# Altium schematic sheet STM32and_conn.SchDoc
size 300 x 299 mm
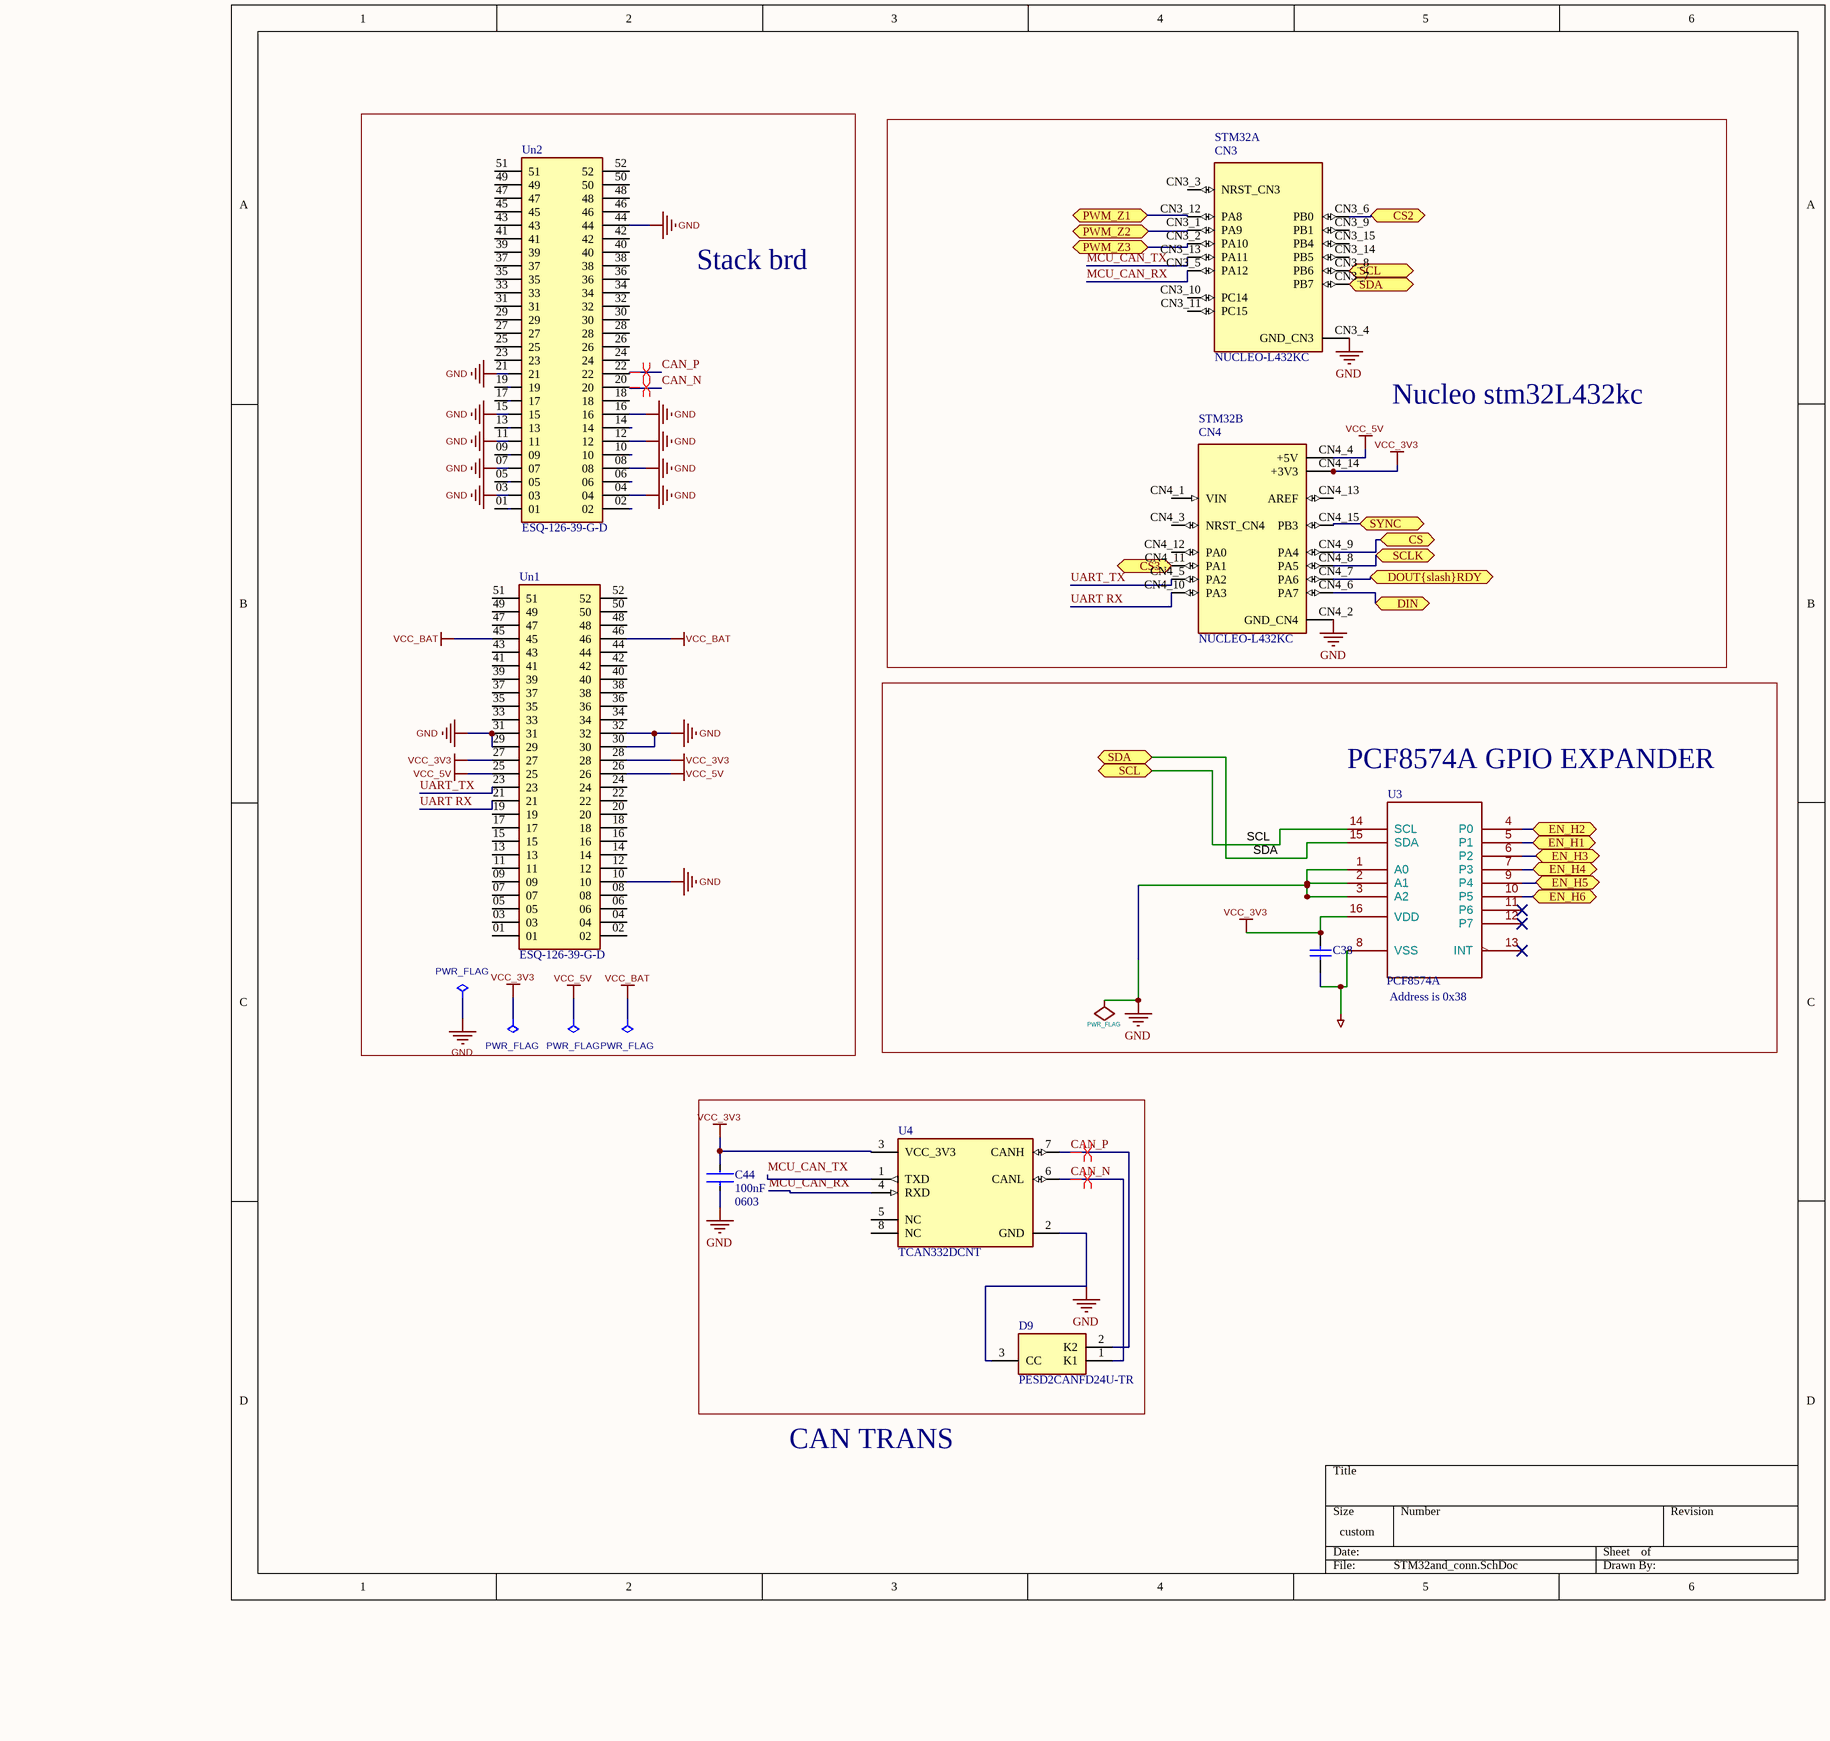
[diagram p0: STM32and_conn.SchDoc]

## Parts
#FLG?#1  PWR_FLAG  (graphical)
#FLG?#2  PWR_FLAG  (graphical)
#FLG?#3  PWR_FLAG  (graphical)
#FLG?#4  PWR_FLAG  (graphical)
#FLG?#5  PWR_FLAG  (graphical)
C38  06035C104KAZ2A  [CAPC1608X90X35LL15T15]  (value not drawn)
C44  Capacitance: 100nF  Case/Package: 0603  [FP-CL10-IPC_A]  (hidden comment: CL10B104KB8WPNC)
D9  PESD2CANFD24U-TR  [SOT95P230X110-3N]
STM32  NUCLEO-L432KC  [MODULE_NUCLEO-L432KC]  (parts A,B of 2)
U3  PCF8574A  [SOIC127P1030X265-16N]
U4  TCAN332DCNT  [FP-DCN0008A-IPC_C]
Un1  ESQ-126-39-G-D  [SAMTEC_ESQ-126-39-G-D]
Un2  ESQ-126-39-G-D  [SAMTEC_ESQ-126-39-G-D]

## Blocks framed on the sheet
Stack brd: #FLG?#1 #FLG?#3-#FLG?#5 Un1 Un2
Nucleo stm32L432kc: STM32
PCF8574A GPIO EXPANDER: #FLG?#2 C38 U3

## Ports
CS2 (bidir), CS3 (bidir), CS (bidir), DIN (bidir), DOUT{slash}RDY (bidir), EN_H1 (bidir), EN_H2 (bidir), EN_H3 (bidir), EN_H4 (bidir), EN_H5 (bidir), EN_H6 (bidir), PWM_Z1 (bidir), PWM_Z2 (bidir), PWM_Z3 (bidir), SCL (bidir), SCLK (bidir), SDA (bidir), SYNC (bidir)

## Nets
GND: #FLG?#1.1 #FLG?#2.1(pwr) C38.1 C44.1 D9.3(CC) STM32.CN3_4(GND_CN3) STM32.CN4_2(GND_CN4) U3.1(A0) U3.2(A1) U3.3(A2) U3.8(VSS) U4.2(GND) Un1.10 Un1.29 Un1.30 Un1.31 Un1.32 Un2.04 Un2.08 Un2.12 Un2.16 Un2.44
VCC_3V3: #FLG?#3.1 C38.2 C44.2 STM32.CN4_14(+3V3) U3.16(VDD) U4.3(VCC_3V3) Un1.27 Un1.28
VCC_5V: #FLG?#4.1 STM32.CN4_4(+5V) Un1.25 Un1.26
VCC_BAT: #FLG?#5.1 Un1.45 Un1.46
CAN_N: D9.1(K1) U4.6(CANL) Un2.20
CAN_P: D9.2(K2) U4.7(CANH) Un2.22
CS: STM32.CN4_9(PA4) ; port CS
CS2: STM32.CN3_6(PB0) ; port CS2
CS3: STM32.CN4_11(PA1) ; port CS3
DIN: STM32.CN4_6(PA7) ; port DIN
DOUT{slash}RDY: STM32.CN4_7(PA6) ; port DOUT{slash}RDY
EN_H1: U3.5(P1) ; port EN_H1
EN_H2: U3.4(P0) ; port EN_H2
EN_H3: U3.6(P2) ; port EN_H3
EN_H4: U3.7(P3) ; port EN_H4
EN_H5: U3.9(P4) ; port EN_H5
EN_H6: U3.10(P5) ; port EN_H6
MCU_CAN_RX: STM32.CN3_5(PA12) U4.4(RXD)
MCU_CAN_TX: STM32.CN3_13(PA11) U4.1(TXD)
PWM_Z1: STM32.CN3_12(PA8) ; port PWM_Z1
PWM_Z2: STM32.CN3_1(PA9) ; port PWM_Z2
PWM_Z3: STM32.CN3_2(PA10) ; port PWM_Z3
SCL: STM32.CN3_8(PB6) U3.14(SCL) ; port SCL
SCLK: STM32.CN4_8(PA5) ; port SCLK
SDA: STM32.CN3_7(PB7) U3.15(SDA) ; port SDA
SYNC: STM32.CN4_15(PB3) ; port SYNC
UART RX: STM32.CN4_10(PA3) Un1.21
UART_TX: STM32.CN4_5(PA2) Un1.23

Not connected (* = marked no-connect by the designer): STM32 CN3_3(NRST_CN3) CN3_9(PB1) CN3_10(PC14) CN3_11(PC15) CN3_14(PB5) CN3_15(PB4) CN4_1(VIN) CN4_3(NRST_CN4) CN4_12(PA0) CN4_13(AREF); U3 11(P6)* 12(P7)* 13(INT)*; U4 5(NC) 8(NC); Un1 01 02 03 04 05 06 07 08 09 11 12 13 14 15 16 17 18 19 20 22 24 33 34 35 36 37 38 39 40 41 42 43 44 47 48 49 50 51 52; Un2 01 02 03 05 06 07 09 10 11 13 14 15 17 18 19 21 23 24 25 26 27 28 29 30 31 32 33 34 35 36 37 38 39 40 41 42 43 45 46 47 48 49 50 51 52

## Layout directives
differential pair: CAN_N, CAN_P

## Notes on the sheet
- (near U3) Address is 0x38
- CAN TRANS
- (in symbol NUCLEO-L432KC, part A) CN3
- (in symbol NUCLEO-L432KC, part B) CN4

## Library data of the parts
C38 = CMP-2006-04391-1: Manufacturer: AVX Interconnect / Elco; Part Number: 06035C104KAZ2A
C44 = CMP-13271-002353-1: Cap Ceramic 100nF 50V X7R ±10% Pad SMD 0603 +125°C T/R; Ratings: AEC-Q200; Features: Soft Termination; Max Operating Temperature: 125°C; Mount: Surface Mount; Width: 0.031inch; Voltage Rating: 50V; Case Code (Metric): 1608; Case Code (Imperial): 0603; Tolerance: 10%; Min Operating Temperature: -55°C; Thickness: 0.035inch; Lead Free: Lead Free; Packaging: Tape and Reel; Length: 0.063inch
D9 = PESD2CANFD24U-TR: Diode; Manufacturer_Name: Nexperia; Datasheet Link: https://assets.nexperia.com/documents/data-sheet/PESD2CANFD24U-T.pdf; Height: 1.1mm; Manufacturer_Part_Number: PESD2CANFD24U-TR; Mouser Part Number: 771-PESD2CANFD24U-TR; Mouser Price/Stock: https://www.mouser.co.uk/ProductDetail/Nexperia/PESD2CANFD24U-TR?qs=vmHwEFxEFR%252BPr2so13o7KA%3D%3D; Arrow Part Number: PESD2CANFD24U-TR; Arrow Price/Stock: https://www.arrow.com/en/products/pesd2canfd24u-tr/nexperia?utm_currency=USD&region=nac
STM32 = NUCLEO-L432KC: STM32L432KC, mbed-Enabled Development Nucleo-32 STM32L4 ARMÂ® CortexÂ®-M4 MCU 32-Bit Embedded Evaluation Board; MF: STMicroelectronics; SnapEDA_Link: https://www.snapeda.com/parts/NUCLEO-L432KC/STMicroelectronics/view-part/?ref=snap; Package: None; Value: *; MP: NUCLEO-L432KC; Check_prices: https://www.snapeda.com/parts/NUCLEO-L432KC/STMicroelectronics/view-part/?ref=eda
U3 = PCF8574
U4 = CMP-04872-000218-1: IC TRANSCEIVER 1/1 SOT23-8; Min Supply Voltage: 3V; Interface: CAN; Max Supply Voltage: 3.6V; Max Operating Temperature: 125°C; Case/Package: SOT-23; Packaging: Cut Tape; Number of Pins: 8; Min Operating Temperature: -40°C; RoHS Compliant: Yes; REACH SVHC: No SVHC; Lead Free: Lead Free
Un1 Un2 = ESQ-126-39-G-D: 52 Position Elevated Socket Connector Through Hole; MF: Samtec; Package: None; MP: ESQ-126-39-G-D; Value: *; Availability: Unavailable; Price: None; SnapEDA_Link: https://www.snapeda.com/parts/ESQ-126-39-G-D/Samtec%20Inc./view-part/490181/?ref=snap
#FLG?#1-#FLG?#5 = PWR_FLAG: Value: PWR_FLAG